# EAGLE design Controller (EAGLE 7.5.0)
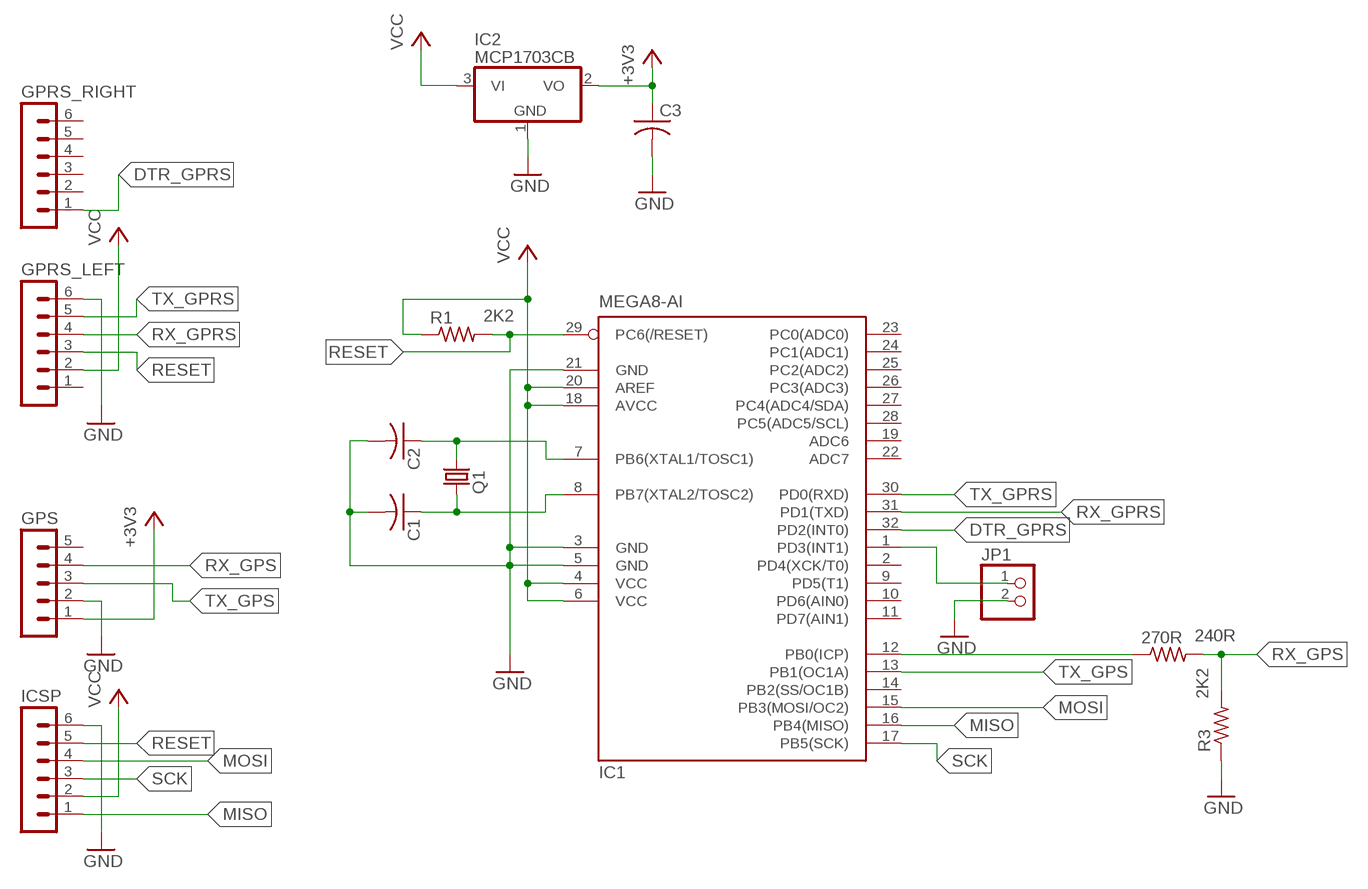
[diagram p0: schematic, sheet 1]

## Parts
270R  240R  R-US_M0805  [M0805]
C1  C-US025-024X044  [C025-024X044]
C2  C-US025-024X044  [C025-024X044]
C3  C-US025-024X044  [C025-024X044]
GPRS_LEFT  MA06-1  [MA06-1]
GPRS_RIGHT  MA06-1  [MA06-1]
GPS  MA05-1  [MA05-1]
IC1  MEGA8-AI  [TQFP32-08]
IC2  MCP1703CB  [SOT23]
ICSP  MA06-1  [MA06-1]
JP1  PINHD-1X2  [1X02]
Q1  CRYSTALHC49U-V  [HC49U-V]
R1  2K2  R-US_M0805  [M0805]
R3  2K2  R-US_M0805  [M0805]

## Nets
+3V3: C3.1 GPS.1 IC2.2(VO)
DTR_GPRS: GPRS_RIGHT.1 IC1.32(PD2(INT0))
GND: C1.2 C2.2 C3.2 GPRS_LEFT.6 GPS.2 IC1.3(GND) IC1.5(GND) IC1.21(GND) IC2.1(GND) ICSP.6 JP1.2 R3.1
MISO: IC1.16(PB4(MISO)) ICSP.1
MOSI: IC1.15(PB3(MOSI/OC2)) ICSP.4
N$2: C2.1 IC1.7(PB6(XTAL1/TOSC1)) Q1.2
N$3: C1.1 IC1.8(PB7(XTAL2/TOSC2)) Q1.1
N$4: IC1.1(PD3(INT1)) JP1.1
NODEGPSTX: 270R.1 IC1.12(PB0(ICP))
RESET: GPRS_LEFT.3 IC1.29(PC6(/RESET)) ICSP.5 R1.2
RX_GPRS: GPRS_LEFT.4 IC1.31(PD1(TXD))
RX_GPS: 270R.2 GPS.4 R3.2
SCK: IC1.17(PB5(SCK)) ICSP.3
TX_GPRS: GPRS_LEFT.5 IC1.30(PD0(RXD))
TX_GPS: GPS.3 IC1.13(PB1(OC1A))
VCC: GPRS_LEFT.2 IC1.4(VCC) IC1.6(VCC) IC1.18(AVCC) IC1.20(AREF) IC2.3(VI) ICSP.2 R1.1
Unconnected: GPRS_LEFT.1 GPRS_RIGHT.2 GPRS_RIGHT.3 GPRS_RIGHT.4 GPRS_RIGHT.5 GPRS_RIGHT.6 GPS.5 IC1.2(PD4(XCK/T0)) IC1.9(PD5(T1)) IC1.10(PD6(AIN0)) IC1.11(PD7(AIN1)) IC1.14(PB2(SS/OC1B)) IC1.19(ADC6) IC1.22(ADC7) IC1.23(PC0(ADC0)) IC1.24(PC1(ADC1)) IC1.25(PC2(ADC2)) IC1.26(PC3(ADC3)) IC1.27(PC4(ADC4/SDA)) IC1.28(PC5(ADC5/SCL))

## Library data of the parts
270R R1 R3 = resistor:R-US_: RESISTOR, American symbol
C1-C3 = rcl:C-US: CAPACITOR, American symbol
GPRS_LEFT GPRS_RIGHT ICSP = con-lstb:MA06-1: PIN HEADER; OC_FARNELL: unknown; OC_NEWARK: unknown
GPS = con-lstb:MA05-1: PIN HEADER; OC_FARNELL: unknown; OC_NEWARK: unknown
IC1 = atmel:MEGA8: MICROCONTROLLER 8 Kbytes FLASH, 1 kbytes SRAM, 512 bytes EEPROM, USART, 6-channel 10 bit ADC, 2-channel 8 bit ADC Pin compatible with Atmega48, ATMega88, ATMega168 Source: avr.lbr; MPN: ATMEGA8-16AU; OC_FARNELL: 9171371; OC_NEWARK: 73M8863
IC2 = linear:MCP1703: 250 mA, 16V, Low Quiescent Current LDO Regulator Source: http://ww1.microchip.com/downloads/en/DeviceDoc/22049b.pdf
JP1 = pinhead:PINHD-1X2: PIN HEADER
Q1 = adafruit:CRYSTAL: CRYSTAL; OC_FARNELL: 1666969; OC_NEWARK: unknown

## Board
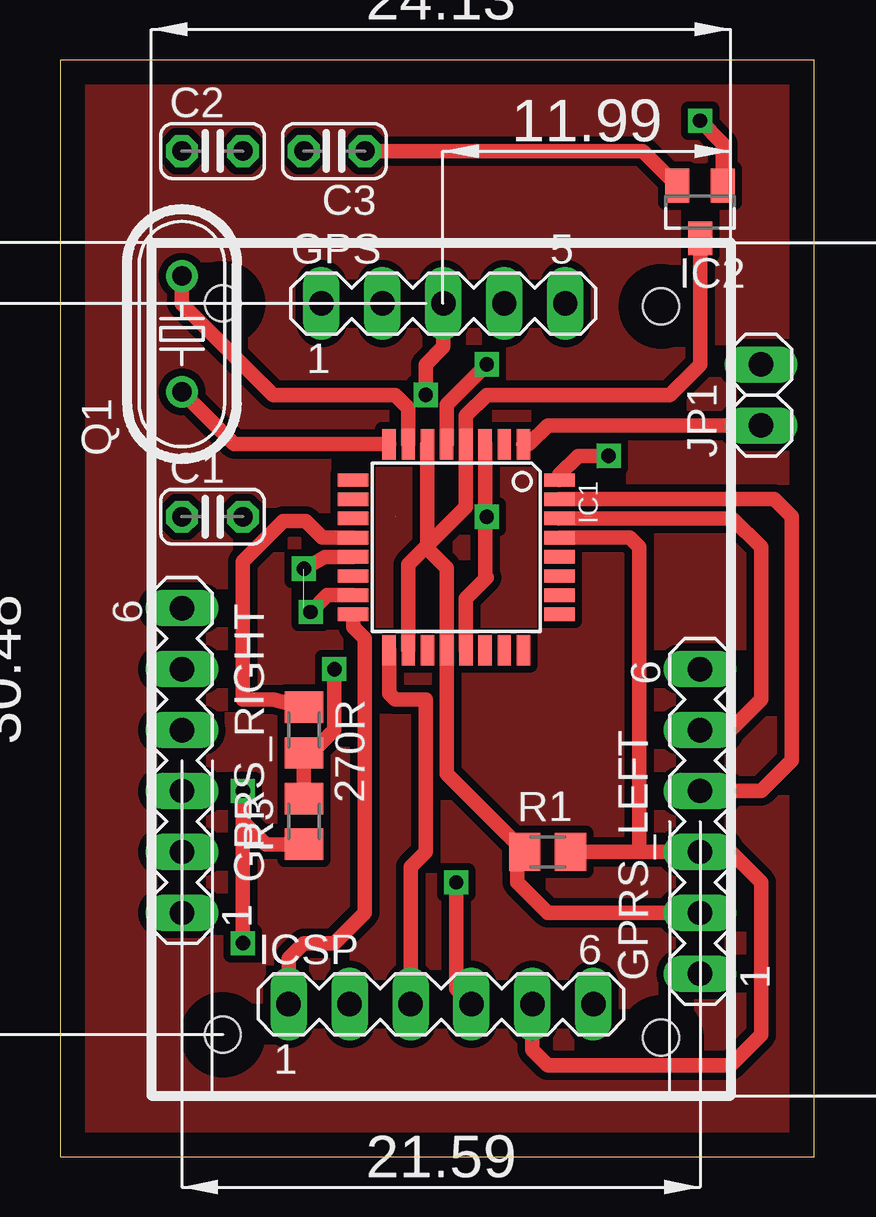
[diagram p1: board, top side]
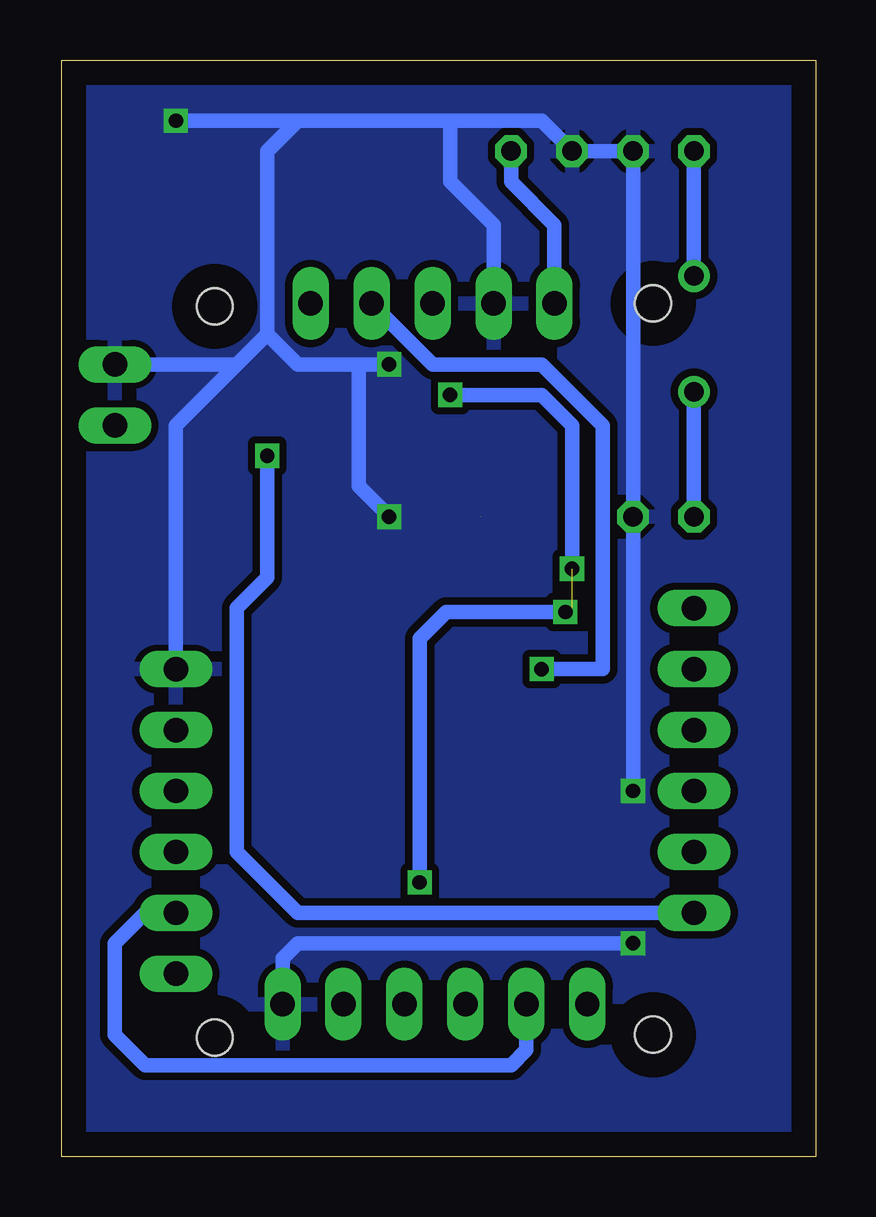
[diagram p2: board, bottom side, seen from below]

Size 31.42 x 45.71 mm. Coordinates in mm from the lower left corner, seen from the top.
Outline: 0,0 31.42,0 31.42,45.71 0,45.71 0,0
Copper layers (1*16): Top 0.035mm / dielectric 1.5mm / Bottom 0.035mm
Design rules "default": minimum track width 10mil, minimum drill 24mil, track to track 8mil, track to pad 8mil, pad to pad 8mil, via to via 8mil, smd to smd 8mil, copper to edge 40mil, drill to drill 8mil, minimum pad ring 10mil, minimum via ring 8mil, stop-mask expansion 4mil, vias tented up to drill 0mil, thermal gap 10mil
Holes 1.5 mm at 25.05,35.44 6.78,35.56 6.78,5.08 25.05,4.96

### Footprints (pad centres in the part's own frame; a part is rotated, then mirrored left to right if it is on the bottom)
M0805 = smd 1.3 x 1.6: 1 -0.95,0; 2 0.95,0
C025-024X044 = drill 0.813 octagon: 1 -1.27,0; 2 1.27,0
MA06-1 = drill 1.016 long: 1 -6.35,0; 2 -3.81,0; 3 -1.27,0; 4 1.27,0; 5 3.81,0; 6 6.35,0
MA05-1 = drill 1.016 long: 1 -5.08,0; 2 -2.54,0; 3 0,0; 4 2.54,0; 5 5.08,0
TQFP32-08 = smd 1.27 x 0.559: 1 -4.293,2.8; 2 -4.293,2; 3 -4.293,1.2; 4 -4.293,0.4; 5 -4.293,-0.4; 6 -4.293,-1.2; 7 -4.293,-2; 8 -4.293,-2.8; 17 4.293,-2.8; 18 4.293,-2; 19 4.293,-1.2; 20 4.293,-0.4; 21 4.293,0.4; 22 4.293,1.2; 23 4.293,2; 24 4.293,2.8 | smd 0.559 x 1.27: 9 -2.8,-4.293; 10 -2,-4.293; 11 -1.2,-4.293; 12 -0.4,-4.293; 13 0.4,-4.293; 14 1.2,-4.293; 15 2,-4.293; 16 2.8,-4.293; 25 2.8,4.293; 26 2,4.293; 27 1.2,4.293; 28 0.4,4.293; 29 -0.4,4.293; 30 -1.2,4.293; 31 -2,4.293; 32 -2.8,4.293
SOT23 = smd 1 x 1.4: 1 -0.95,-1.1; 2 0.95,-1.1; 3 0,1.1
1X02 = drill 1.016 long: 1 -1.27,0; 2 1.27,0
HC49U-V = drill 0.813: 1 -2.413,0; 2 2.413,0

### Placement (x,y rotation side)
270R  10.16,17.78 270 top
C1  6.35,26.67 0 top
C2  6.35,41.91 0 top
C3  11.43,41.91 180 top
GPRS_LEFT  26.67,13.97 90 top
GPRS_RIGHT  5.08,16.51 90 top
GPS  15.97,35.56 0 top
IC1  16.51,25.4 270 top
IC2  26.67,39.37 180 top
ICSP  15.88,6.35 0 top
JP1  29.21,31.75 90 top
Q1  5.08,34.29 90 top
R1  20.32,12.7 0 top
R3  10.16,13.97 90 top

### Tracks (layer width: path | path; a pad name or v marks a point on that pad's centre or on a via)
+3V3
  Top 0.61: C3.1 24.28,41.91 IC2.2
  Bottom 0.61: GPS.1 10.89,38.83 12.7,40.64 C3.1
DTR_GPRS  (via drill 0.6)
  Top 0.61: v22.86,29.21 21.59,29.21 20.8,28.42 IC1.32
  Bottom 0.61: GPRS_RIGHT.1 21.59,10.16 24.13,12.7 24.13,22.86 22.86,24.13 v22.86,29.21
GND  (via drill 0.6)
  Top 0.61: IC1.5 16.11,31.35 v17.78,33.02 | IC2.1 27.62,42.23 v26.67,43.18 | IC1.21 16.91,23.26 17.78,24.13 17.71,24.2 IC1.3 17.71,26.74 v17.78,26.67 | R3.1 8.57,13.02 7.62,13.97 | 7.62,13.97 v7.62,15.24 | v7.62,8.89 7.62,13.97
  Bottom 0.61: v17.78,33.02 19.05,33.02 | 19.05,33.02 21.59,33.02 22.86,34.29 | 22.86,34.29 22.86,41.91 21.59,43.18 | 21.59,43.18 15.24,43.18 | 15.24,43.18 11.43,43.18 C3.2 C2.2 C1.2 v7.62,15.24 | GPS.2 13.43,38.83 15.24,40.64 15.24,43.18 | GPRS_LEFT.6 26.67,30.48 24.13,33.02 | 24.13,33.02 22.86,34.29 | v26.67,43.18 21.59,43.18 | v17.78,26.67 19.05,27.94 19.05,33.02 | ICSP.6 22.22,8.26 21.59,8.89 v7.62,8.89 | JP1.2 24.13,33.02
  pour Bottom (isolate 0.305): 0,45.72 31.75,45.72 31.75,0 0,0
MISO
  Top 0.61: IC1.16 12.22,22.07 12.7,21.59 12.7,10.16 11.43,8.89 10.16,8.89 9.53,8.26 ICSP.1
MOSI  (via drill 0.6)
  Top 0.61: IC1.15 11.14,23.4 v10.44,22.7 | v16.51,11.43 16.51,6.99 ICSP.4
  Bottom 0.61: v10.44,22.7 15.4,22.7 16.51,21.59 v16.51,11.43
N$1  (1 unrouted)
N$2
  Top 0.61: IC1.7 14.51,31.21 13.97,31.75 8.89,31.75 5.08,35.56 Q1.2
  Bottom 0.61: Q1.2 C2.1
N$3
  Top 0.61: IC1.8 7.26,29.69 Q1.1
  Bottom 0.61: Q1.1 C1.1
N$4
  Top 0.61: IC1.1 19.53,29.69 20.32,30.48 JP1.1
N$5
  pour Top (isolate 0.305): 0,45.72 31.75,45.72 31.75,0 0,0
NODEGPSTX
  Top 0.61: 270R.1 8.89,19.05 7.62,19.05 7.62,24.13 | IC1.12 10.92,25.8 10.23,26.49 9.3,26.49 8.45,25.63 7.62,24.8 7.62,24.13 | 7.62,24.13
RESET
  Top 0.61: 24.13,12.7 GPRS_LEFT.3 27.94,12.7 29.21,11.43 29.21,5.08 27.94,3.81 20.32,3.81 19.68,4.45 ICSP.5 | 24.13,12.7 R1.2 | IC1.29 23.73,25.8 24.13,25.4 24.13,12.7
RX_GPRS
  Top 0.61: GPRS_LEFT.4 29.21,15.24 30.48,16.51 30.48,26.67 29.75,27.4 IC1.31
RX_GPS  (via drill 0.6)
  Top 0.61: 10.16,16.51 R3.2 | v11.43,20.32 11.43,17.78 10.16,16.51 | 10.16,16.51 270R.2
  Bottom 0.61: v11.43,20.32 8.89,20.32 8.89,30.48 11.43,33.02 15.97,33.02 GPS.4
SCK
  Top 0.61: ICSP.3 14.61,12.06 15.24,12.7 15.24,19.05 13.97,19.05 13.71,19.31 IC1.17
TX_GPRS
  Top 0.61: GPRS_LEFT.5 27.94,17.78 29.21,19.05 29.21,25.4 28.01,26.6 IC1.30
TX_GPS  (via drill 0.6)  (1 unrouted)
  Top 0.61: GPS.3 15.97,33.75 15.24,33.02 v15.24,31.75 | IC1.13 11.03,25 v10.16,24.5
  Bottom 0.61: v15.24,31.75 11.43,31.75 10.16,30.48 v10.16,24.5
VCC
  Top 0.61: GPRS_LEFT.2 20.32,10.16 19.05,11.43 19.05,12.38 R1.1 16.11,15.96 IC1.20 16.11,24.53 15.24,25.4 | IC1.6 15.31,25.47 | 15.31,25.47 15.24,25.4 | 15.31,25.47 16.91,27.07 IC1.4 16.91,30.88 17.78,31.75 25.4,31.75 26.67,33.02 IC2.3 | IC1.18 14.51,24.67 15.24,25.4
  Bottom 0.61: ICSP.2 12.06,4.45 12.7,3.81 27.94,3.81 29.21,5.08 29.21,8.89 27.94,10.16 GPRS_LEFT.2